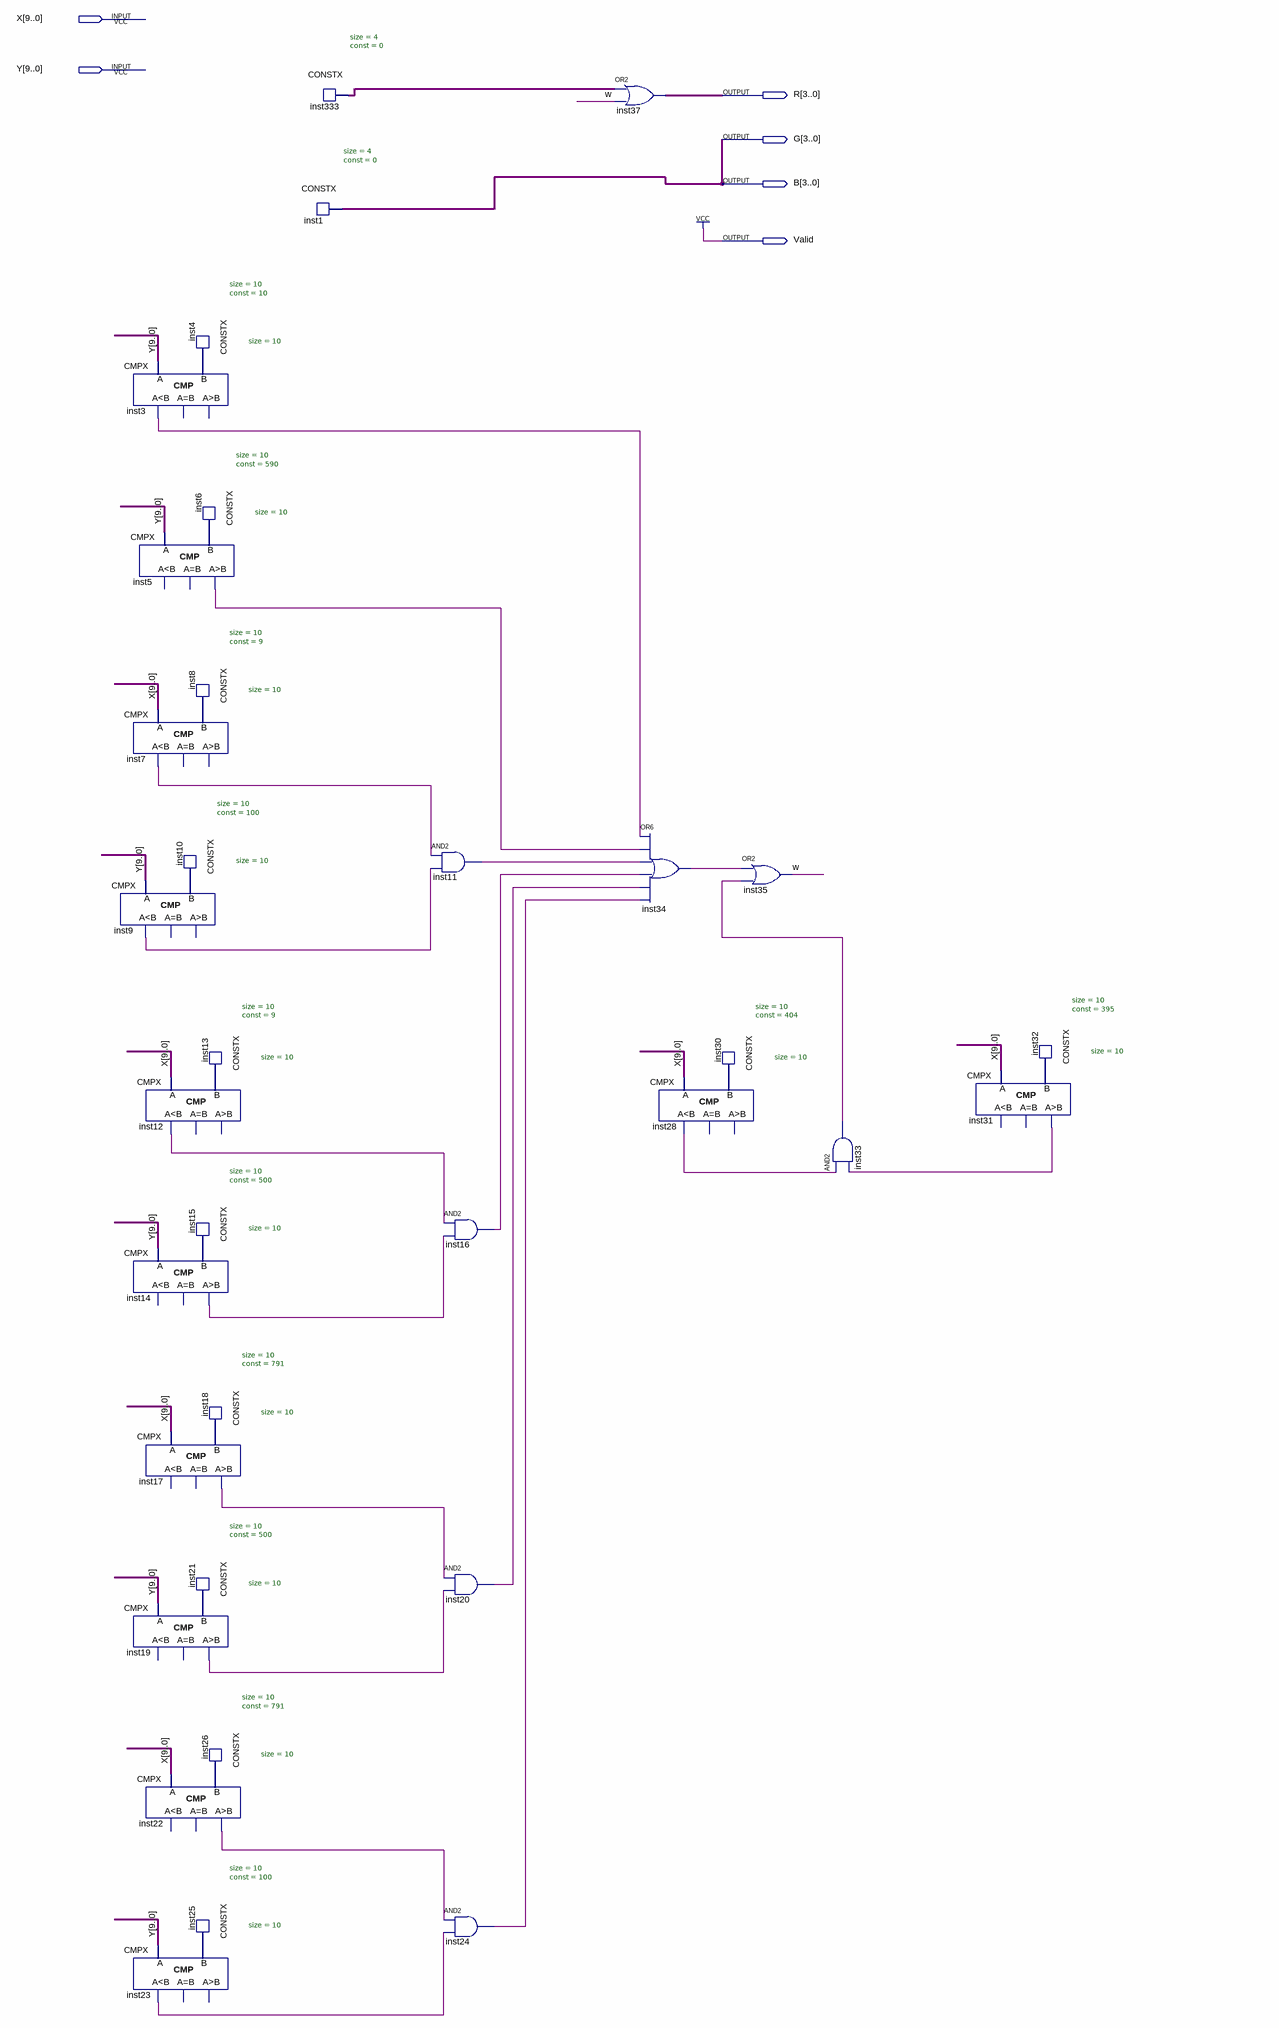
[diagram p0: schematic sheet]
// Quartus schematic Layer0.bdf as structural Verilog: 34 symbols, 6 pins
module Layer0 (
  input  [9:0] X,
  input  [9:0] Y,
  output [3:0] R,
  output [3:0] G,
  output [3:0] B,
  output Valid
);

  wire inst3_ls, inst5_gr, inst7_ls, inst9_ls, inst11_out, inst12_ls, inst14_gr, inst16_out, inst17_gr,
       inst19_gr, inst20_out, inst22_gr, inst23_ls, inst24_out, inst28_ls, inst31_gr, inst33_out, inst34_out,
       w;
  wire [3:0] inst333_data;
  wire [9:0] inst4_data, inst6_data, inst8_data, inst10_data, inst13_data, inst15_data, inst18_data,
       inst21_data, inst25_data, inst26_data, inst30_data, inst32_data;

  CMPX #(.size(10)) inst3 (.A(Y), .B(inst4_data), .ls(inst3_ls));  // open: eq, gr
  CMPX #(.size(10)) inst5 (.A(Y), .B(inst6_data), .gr(inst5_gr));  // open: ls, eq
  CMPX #(.size(10)) inst7 (.A(X), .B(inst8_data), .ls(inst7_ls));  // open: eq, gr
  CMPX #(.size(10)) inst9 (.A(Y), .B(inst10_data), .ls(inst9_ls));  // open: eq, gr
  CMPX #(.size(10)) inst14 (.A(Y), .B(inst15_data), .gr(inst14_gr));  // open: ls, eq
  CMPX #(.size(10)) inst19 (.A(Y), .B(inst21_data), .gr(inst19_gr));  // open: ls, eq
  CMPX #(.size(10)) inst23 (.A(Y), .B(inst25_data), .ls(inst23_ls));  // open: eq, gr
  CONSTX #(.size(10), .\const (100)) inst10 (.data(inst10_data));
  CMPX #(.size(10)) inst12 (.A(X), .B(inst13_data), .ls(inst12_ls));  // open: eq, gr
  CMPX #(.size(10)) inst17 (.A(X), .B(inst18_data), .gr(inst17_gr));  // open: ls, eq
  CMPX #(.size(10)) inst22 (.A(X), .B(inst26_data), .gr(inst22_gr));  // open: ls, eq
  CONSTX #(.size(10), .\const (10)) inst4 (.data(inst4_data));
  CONSTX #(.size(10), .\const (590)) inst6 (.data(inst6_data));
  CONSTX #(.size(10), .\const (9)) inst8 (.data(inst8_data));
  CONSTX #(.size(10), .\const (9)) inst13 (.data(inst13_data));
  CONSTX #(.size(10), .\const (500)) inst15 (.data(inst15_data));
  CONSTX #(.size(10), .\const (791)) inst18 (.data(inst18_data));
  CONSTX #(.size(10), .\const (500)) inst21 (.data(inst21_data));
  CONSTX #(.size(10), .\const (791)) inst26 (.data(inst26_data));
  CONSTX #(.size(10), .\const (100)) inst25 (.data(inst25_data));
  CONSTX #(.size(4), .\const (0)) inst333 (.data(inst333_data));
  CONSTX #(.size(4), .\const (0)) inst1 (.data(B));
  and inst11 (inst11_out, inst7_ls, inst9_ls);
  and inst16 (inst16_out, inst12_ls, inst14_gr);
  and inst20 (inst20_out, inst17_gr, inst19_gr);
  and inst24 (inst24_out, inst22_gr, inst23_ls);
  assign R = inst333_data | {4{w}};  // OR2 inst37, 4 bits wide
  or inst34 (inst34_out, inst3_ls, inst5_gr, inst11_out, inst16_out, inst20_out, inst24_out);
  CMPX #(.size(10)) inst28 (.A(X), .B(inst30_data), .ls(inst28_ls));  // open: eq, gr
  CONSTX #(.size(10), .\const (404)) inst30 (.data(inst30_data));
  or inst35 (w, inst34_out, inst33_out);
  and inst33 (inst33_out, inst28_ls, inst31_gr);
  CMPX #(.size(10)) inst31 (.A(X), .B(inst32_data), .gr(inst31_gr));  // open: ls, eq
  CONSTX #(.size(10), .\const (395)) inst32 (.data(inst32_data));

  assign G = B;
  assign Valid = 1'b1;
endmodule
